# EAGLE design buslamp-r4 (EAGLE 6.4)
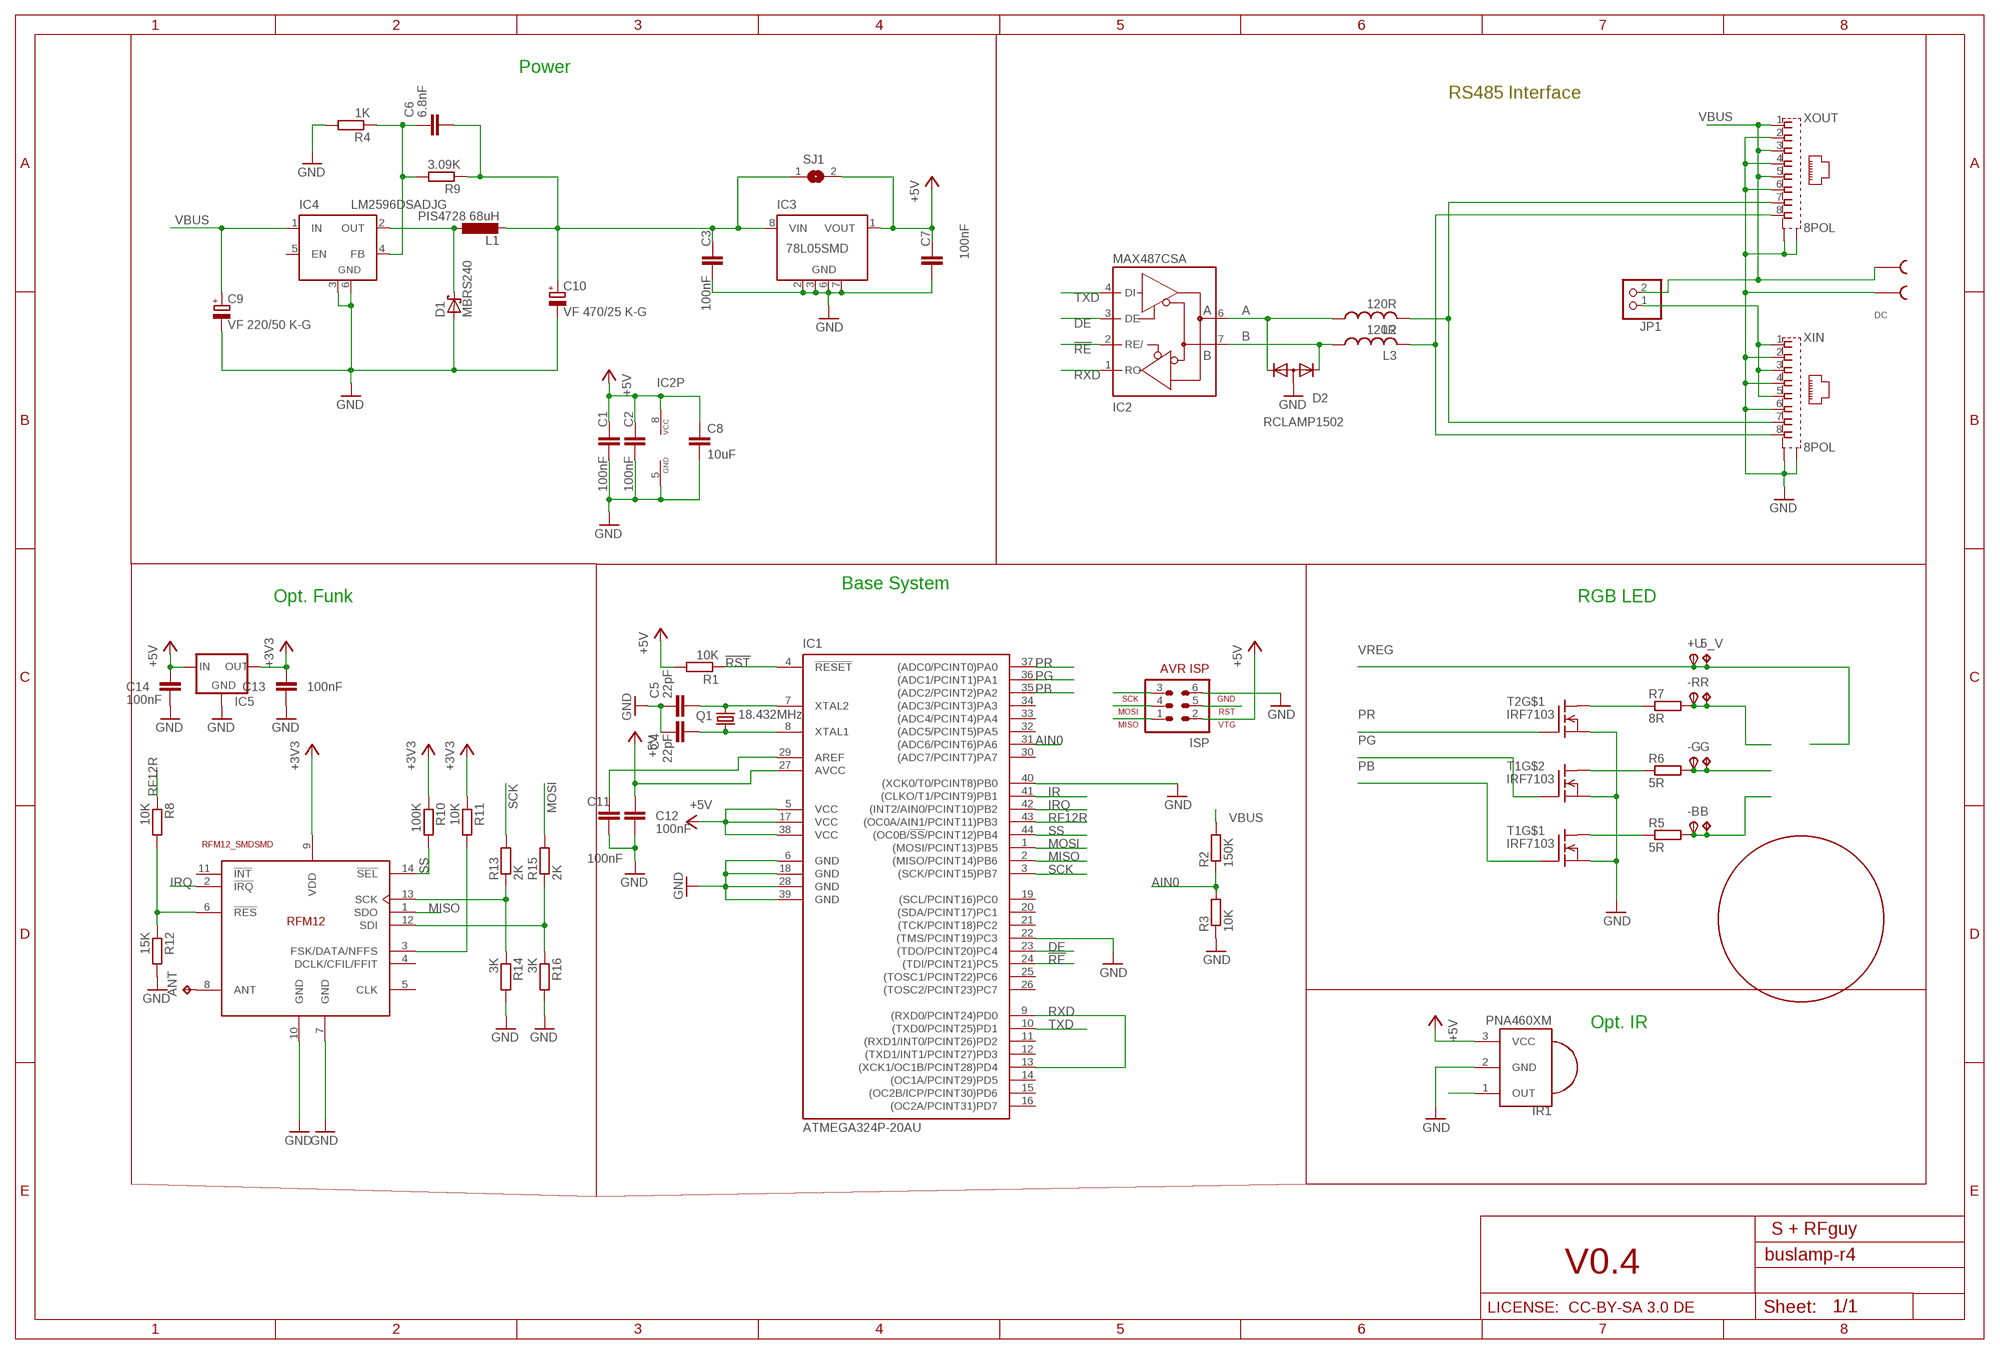
[diagram p0: schematic, sheet 1]

## Parts
5_V  TPPAD1-13  [P1-13]
+U  TPSTP212R  [TP212R]
-B  TPSTP212R  [TP212R]
-G  TPSTP212R  [TP212R]
-R  TPSTP212R  [TP212R]
ANT  TPPAD1-13  [P1-13]
B  TPPAD1-13  [P1-13]
C1  100nF  C-EUC0805K  [C0805K]
C2  100nF  C-EUC0805K  [C0805K]
C3  100nF  C-EUC0805K  [C0805K]
C4  22pF  C-EUC0805K  [C0805K]
C5  22pF  C-EUC0805K  [C0805K]
C6  6.8nF  C-EUC0805K  [C0805K]
C7  100nF  C-EUC0805K  [C0805K]
C8  10uF  C-EUC1210  [C1210]
C9  VF 220/50 K-G  CPOL-EUUD-10X10  [UD-10X10_NICHICON]
C10  VF 470/25 K-G  CPOL-EUUD-10X10  [UD-10X10_NICHICON]
C11  100nF  C-EUC0805  [C0805]
C12  100nF  C-EUC0805  [C0805]
C13  100nF  C-EUC0805  [C0805]
C14  100nF  C-EUC0805  [C0805]
D1  MBRS240  MBRS130LT3  [SMB]
D2  RCLAMP1502  DIODE-2CA|ACSOT23  [SOT23]
DC  STL-266-2  [STL-266-2]
G  TPPAD1-13  [P1-13]
IC1  ATMEGA324P-20AU  MEGA164P/324P/644P-AU  [TQFP44]
IC2  MAX487CSA  MAX481CSA  [SO08]
IC3  78L05SMD  [SO08]
IC4  LM2596DSADJG  LM2596S  [TO263-5]
IC5  MCP1700SOT23  [SOT23]
IR1  PNA460XM  [PNA460XM]
ISP  AVR-ISP-6  [AVR-ISP-6]
JP1  PINHD-1X2  [1X02]
L1  PIS4728 68uH  PSI4728  [PIS4728]
L2  120R  L-USL0603  [L0603]
L3  120R  L-USL0603  [L0603]
Q1  18.432MHz  CRYTALHC49S  [HC49/S]
R  TPPAD1-13  [P1-13]
R1  10K  R-EU_M0805  [M0805]
R2  150K  R-EU_R0805  [R0805]
R3  10K  R-EU_R0805  [R0805]
R4  1K  R-EU_M0805  [M0805]
R5  5R  R-EU_0617/17  [0617/17]
R6  5R  R-EU_0617/17  [0617/17]
R7  8R  R-EU_0617/17  [0617/17]
R8  10K  R-EU_M0805  [M0805]
R9  3.09K  R-EU_M0805  [M0805]
R10  100K  R-EU_M0805  [M0805]
R11  10K  R-EU_M0805  [M0805]
R12  15K  R-EU_M0805  [M0805]
R13  2K  R-EU_M0805  [M0805]
R14  3K  R-EU_M0805  [M0805]
R15  2K  R-EU_M0805  [M0805]
R16  3K  R-EU_M0805  [M0805]
RF1  RFM12_SMDSMD  [RFM12]
SJ1  SJ  [SJ]
T1  IRF7103  [SO-8]
T2  IRF7103  [SO-8]
U$2  KK-STERN  [STERN]
XIN  8POL  [8POL]
XOUT  8POL  [8POL]

## Nets
!RE: IC1.24((TDI/PCINT21)PC5) IC2.2(RE/)
!RST: IC1.4(!RESET) ISP.5 R1.1
+3V3: C13.2 IC5.2(OUT) R10.1 R11.1 RF1.9(VDD)
+5V: C1.1 C2.1 C7.1 C8.1 C12.2 C14.2 IC1.5(VCC) IC1.17(VCC) IC1.27(AVCC) IC1.38(VCC) IC2.8(VCC) IC3.1(VOUT) IC5.3(IN) IR1.3(VCC) ISP.2 R1.2 SJ1.2
A: L2.2 XIN.7 XOUT.7
AIN0: IC1.31((ADC6/PCINT6)PA6) R2.1 R3.2
B: L3.2 XIN.8 XOUT.8
DE: IC1.23((TDO/PCINT20)PC4) IC2.3(DE)
G: -G.TP(PP) G.TP R6.2
GND: C1.2 C2.2 C3.2 C4.1 C5.1 C7.2 C8.2 C9.- C10.- C11.1 C12.1 C13.1 C14.1 D1.A D2.3(A) DC.P$3 IC1.6(GND) IC1.18(GND) IC1.22((TMS/PCINT19)PC3) IC1.28(GND) IC1.39(GND) IC1.40((XCK0/T0/PCINT8)PB0) IC2.5(GND) IC3.2(GND) IC3.3(GND) IC3.6(GND) IC3.7(GND) IC4.3(GND) IC4.6(GND) IC5.1(GND) IR1.2(GND) ISP.6 R3.1 R4.2 R12.2 R14.2 R16.2 RF1.7(GND) RF1.10(GND) T1.1(S) T1.3(S) T2.1(S) XIN.2 XIN.4 XIN.6 XIN.S1 XIN.S2 XOUT.2 XOUT.4 XOUT.6 XOUT.S1 XOUT.S2
IR: IC1.41((CLKO/T1/PCINT9)PB1) IR1.1(OUT)
IRQ: IC1.42((INT2/AIN0/PCINT10)PB2) RF1.2(!IRQ)
MISO: IC1.2((MISO/PCINT14)PB6) ISP.1 RF1.1(SDO)
MOSI: IC1.1((MOSI/PCINT13)PB5) ISP.4 R15.2
N$1: R7.1 T2.8(D1)
N$2: R8.2 R12.1 RF1.6(!RES)
N$3: C6.1 IC4.4(FB) R4.1 R9.2
N$4: R6.1 T1.5(D1)
N$5: R5.1 T1.8(D1)
N$6: -B.TP(PP) B.TP R5.2
N$7: R13.1 R14.1 RF1.13(SCK)
N$8: R15.1 R16.1 RF1.12(SDI)
N$9: ANT.TP RF1.8(ANT)
N$10: D1.C IC4.2(OUT) L1.1
N$12: D2.2(K2) IC2.6(A) L2.1
N$13: D2.1(K1) IC2.7(B) L3.1
N$15: R11.2 RF1.3(FSK/DATA/NFFS)
N$29: C11.2 IC1.29(AREF)
PB: IC1.35((ADC2/PCINT2)PA2) T1.2(G)
PG: IC1.36((ADC1/PCINT1)PA1) T1.4(G)
PR: IC1.37((ADC0/PCINT0)PA0) T2.2(G)
R: -R.TP(PP) R7.2 R.TP
RF12R: IC1.43((OC0A/AIN1/PCINT11)PB3) R8.1
RXD: IC1.9((RXD0/PCINT24)PD0) IC1.13((XCK1/OC1B/PCINT28)PD4) IC2.1(RO)
SCK: IC1.3((SCK/PCINT15)PB7) ISP.3 R13.2
SS: IC1.44((OC0B/!SS!/PCINT12)PB4) R10.2 RF1.14(!SEL)
TXD: IC1.10((TXD0/PCINT25)PD1) IC2.4(DI)
VBUS: C9.+ DC.P$4 IC4.1(IN) JP1.2 R2.2 XOUT.1 XOUT.3 XOUT.5
VBUSOUT: JP1.1 XIN.1 XIN.3 XIN.5
VREG: 5_V.TP +U.TP(PP) C3.1 C6.2 C10.+ IC3.8(VIN) L1.2 R9.1 SJ1.1
XTAL1: C5.2 IC1.7(XTAL2) Q1.2
XTAL2: C4.2 IC1.8(XTAL1) Q1.1
Unconnected: IC1.11((RXD1/INT0/PCINT26)PD2) IC1.12((TXD1/INT1/PCINT27)PD3) IC1.14((OC1A/PCINT29)PD5) IC1.15((OC2B/ICP/PCINT30)PD6) IC1.16((OC2A/PCINT31)PD7) IC1.19((SCL/PCINT16)PC0) IC1.20((SDA/PCINT17)PC1) IC1.21((TCK/PCINT18)PC2) IC1.25((TOSC1/PCINT22)PC6) IC1.26((TOSC2/PCINT23)PC7) IC1.30((ADC7/PCINT7)PA7) IC1.32((ADC5/PCINT5)PA5) IC1.33((ADC4/PCINT4)PA4) IC1.34((ADC3/PCINT3)PA3) IC3.4(NC) IC3.5(NC) IC4.5(EN) RF1.4(DCLK/CFIL/FFIT) RF1.5(CLK) RF1.11(!INT) T1.6(D) T1.7(D) T2.3(S) T2.4(G) T2.5(D1) T2.6(D) T2.7(D)

## Notes on the sheet
- Power
- RS485 Interface
- Base System
- Opt. Funk | RGB LED
- RF12R | IR
- SCK | IRQ
- MOSI
- RF12R
- SS
- MOSI
- MISO
- SS | SCK
- IRQ
- MISO
- Opt. IR
- S + RFguy
- V0.4
- LICENSE:  CC-BY-SA 3.0 DE

## Library data of the parts
5_V ANT B G R = testpad:TP: Test pad
+U -B -G -R = testpad:TPS: TEST PIN
C1-C8 C11-C14 = rcl:C-EU: CAPACITOR, European symbol
C9 C10 = rcl:CPOL-EU: POLARIZED CAPACITOR, European symbol
D1 = diode:MBRS130LT3: Schottky Power Rectifier Source: http://www.onsemi.com/pub/Collateral/MBRS130LT3-D.PDF
D2 = diode:DIODE-2CA|AC: Dual DIODE Cathode-Anode|Anode-Cathode
DC = xtort:STL-266-2
IC1 = avr-5:MEGA164P/324P/644P-AU
IC2 = maxim:MAX481CSA: RS485 TRANSEIVER
IC3 = linear:78L*SMD: Positive VOLTAGE REGULATOR
IC4 = linear:LM2596S: STEP-DOWN VOLTAGE REGULATOR
IC5 = adafruit:MCP1700: VOLTAGE REGULATOR
IR1 = adafruit:PNA460XM: IR 38KHz receiver PNA4602 and related receivers http://www.ladyada.net/library/pcb/eaglelibrary.html
ISP = avr-6:AVR-ISP-6: AVR ISP-6 Serial Programming Header
JP1 = pinhead:PINHD-1X2: PIN HEADER
L1 = rcl:PSI4728
L2 L3 = rcl:L-US: INDUCTOR, American symbol
Q1 = crystal:CRYTAL: CRYSTAL
R1-R4 R8-R16 = rcl:R-EU_: RESISTOR, European symbol
R5-R7 = rclml:R-EU_: RESISTOR, European symbol
RF1 = rfm_12:RFM12_SMD: RFM12 is a low costing ISM band transceiver module implemented with unique PLL. It works signal ranges from 315/433/868/915MHZ bands, comply with FCC, ETSI regulation. The SPI interface is used to communicate with microcontroller for parameter setting.
SJ1 = jumper:SJ: SMD solder JUMPER
T1 T2 = transistor-fet+irf7201:IRF7103
U$2 = ledccc:KK-STERN: LED Kühlkörper Stern
XIN XOUT = con-amp:8POL

## Board
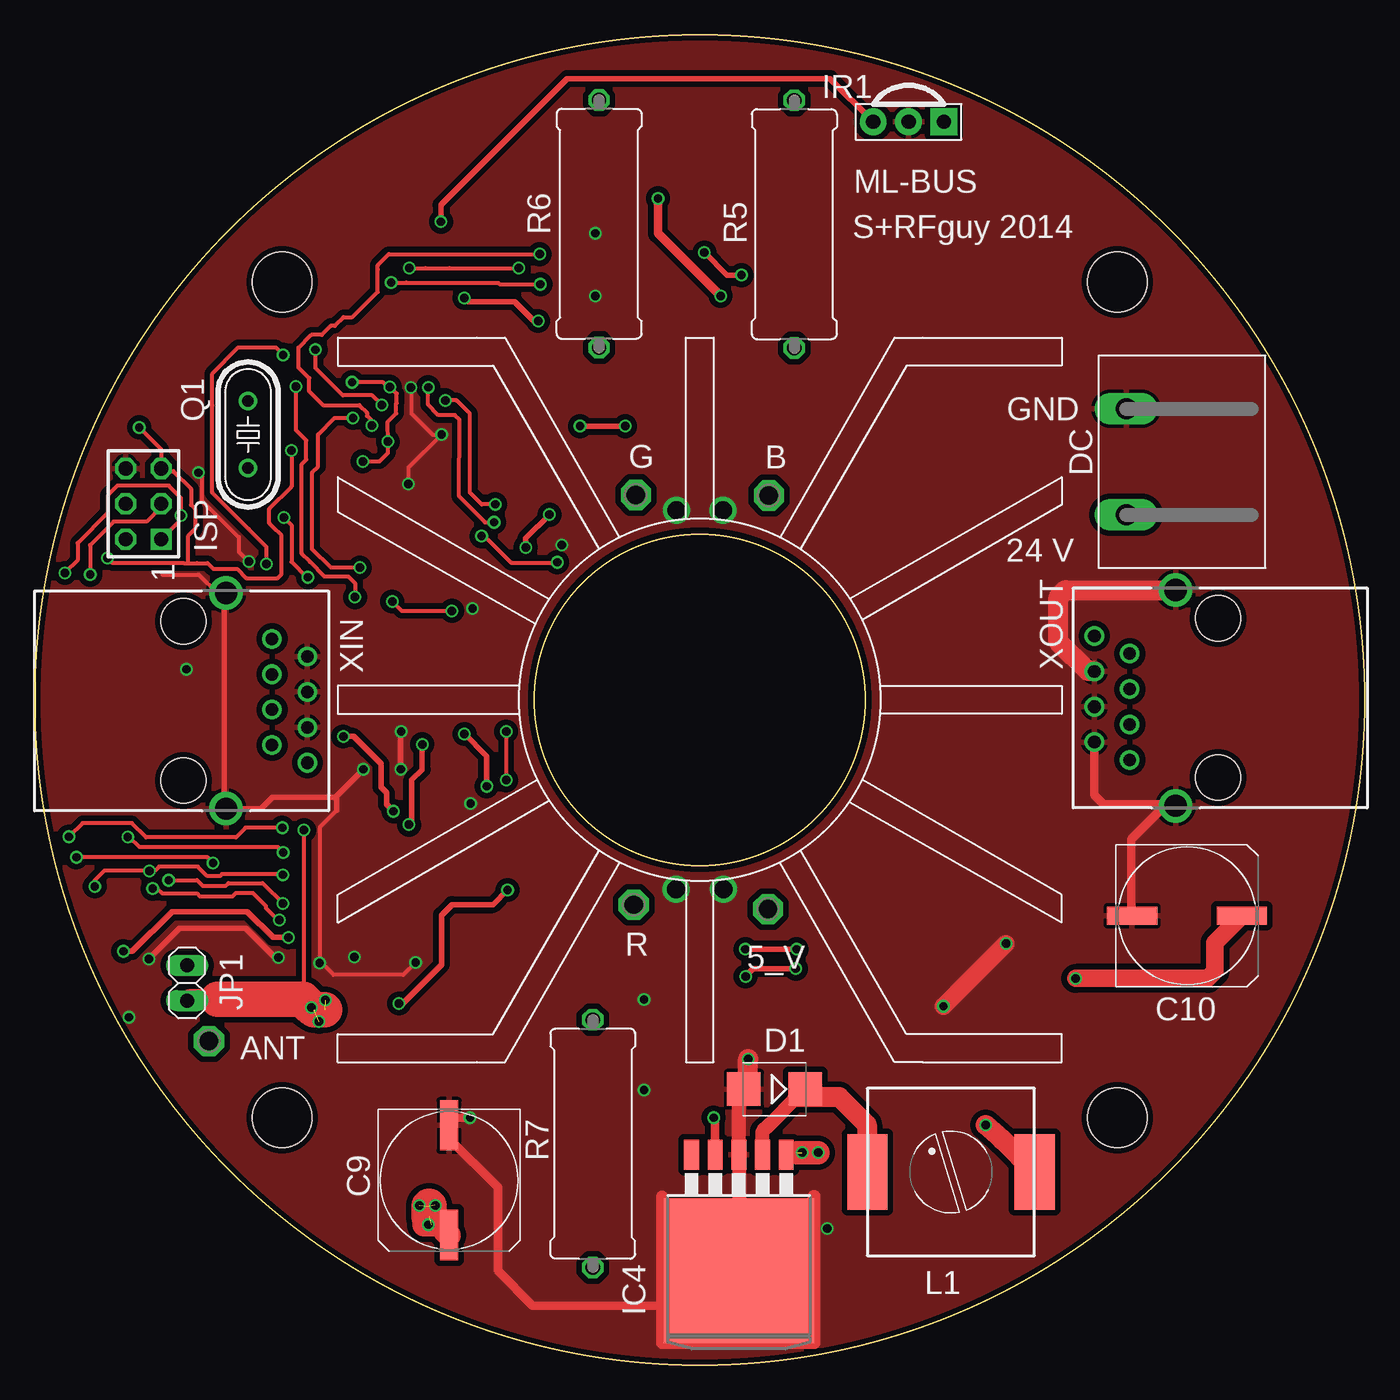
[diagram p1: board, top side]
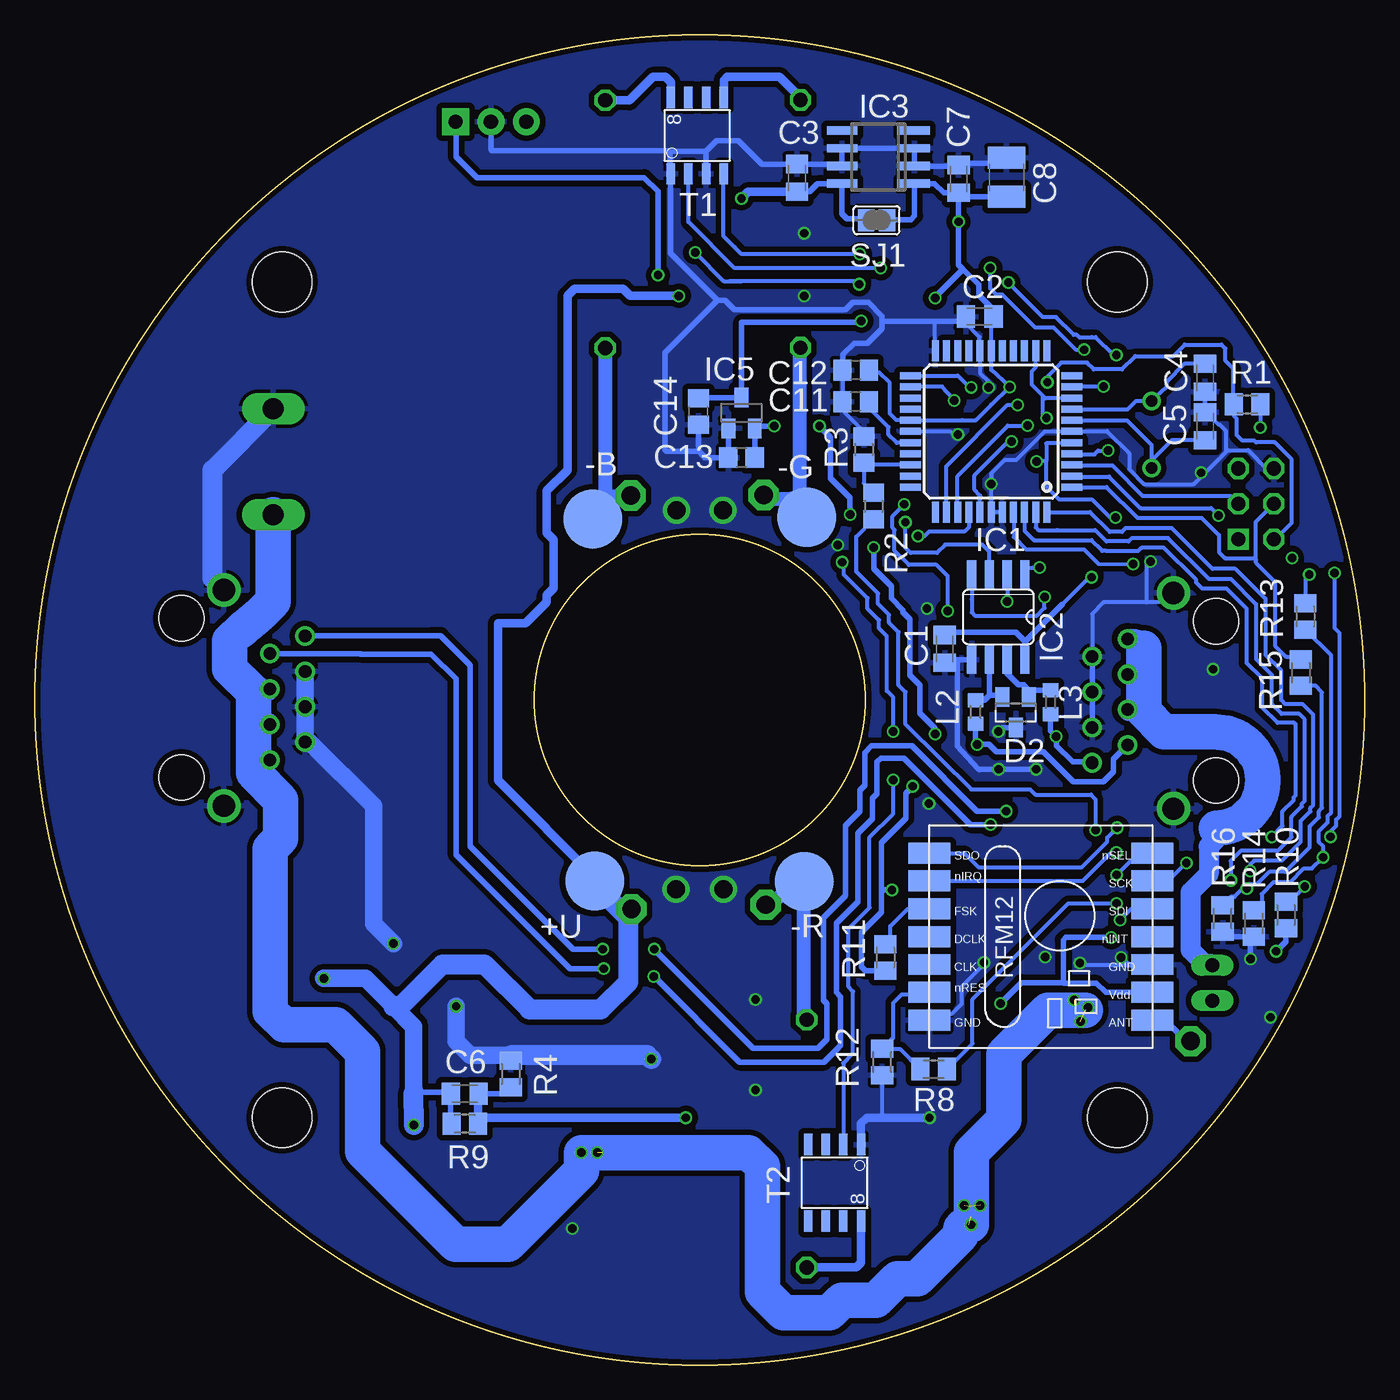
[diagram p2: board, bottom side, seen from below]

Size 95.51 x 95.51 mm. Coordinates in mm from the lower left corner, seen from the top.
Outline: circle at 47.76,47.77 radius 11.88
Outline: circle at 47.76,47.76 radius 47.76
Copper layers (1*16): Top 0.035mm / dielectric 1.5mm / Bottom 0.035mm
Design rules "SeeedStudio_2layer_DRU_no_angle_20140221": minimum track width 6mil, minimum drill 12mil, track to track 6mil, track to pad 6mil, pad to pad 6mil, via to via 6mil, smd to smd 0mil, copper to edge 10mil, drill to drill 10mil, minimum pad ring 10mil, minimum via ring 6mil, stop-mask expansion 2mil, vias tented up to drill 100mil, thermal gap 10mil
Holes 4.3 mm at 77.76,77.77 17.76,17.77 17.76,77.77 77.76,17.77

### Footprints (pad centres in the part's own frame; a part is rotated, then mirrored left to right if it is on the bottom)
P1-13 = drill 1.321 pad 2.159 octagon: TP 0,0
TP212R = smd 4.24 x 4.24: TP 0,0
C0805K = smd 1.3 x 1.6: 1 -1,0; 2 1,0
C1210 = smd 1.6 x 2.7: 1 -1.4,0; 2 1.4,0
UD-10X10_NICHICON = smd 3.6 x 1.3: + 3.925,0; - -3.95,0
C0805 = smd 1.3 x 1.5: 1 -0.95,0; 2 0.95,0
SMB = smd 2.4 x 2.4: A 2.2,0; C -2.2,0
SOT23 = smd 1 x 1.4: 1 -0.95,-1.1; 2 0.95,-1.1; 3 0,1.1
STL-266-2 = drill 1.5 long: P$3 -3.81,-4; P$4 3.81,-4
TQFP44 = smd 1.5 x 0.5: 1 -5.8,4; 2 -5.8,3.2; 3 -5.8,2.4; 4 -5.8,1.6; 5 -5.8,0.8; 6 -5.8,0; 7 -5.8,-0.8; 8 -5.8,-1.6; 9 -5.8,-2.4; 10 -5.8,-3.2; 11 -5.8,-4; 23 5.8,-4; 24 5.8,-3.2; 25 5.8,-2.4; 26 5.8,-1.6; 27 5.8,-0.8; 28 5.8,0; 29 5.8,0.8; 30 5.8,1.6; 31 5.8,2.4; 32 5.8,3.2; 33 5.8,4 | smd 0.5 x 1.5: 12 -4,-5.8; 13 -3.2,-5.8; 14 -2.4,-5.8; 15 -1.6,-5.8; 16 -0.8,-5.8; 17 0,-5.8; 18 0.8,-5.8; 19 1.6,-5.8; 20 2.4,-5.8; 21 3.2,-5.8; 22 4,-5.8; 34 4,5.8; 35 3.2,5.8; 36 2.4,5.8; 37 1.6,5.8; 38 0.8,5.8; 39 0,5.8; 40 -0.8,5.8; 41 -1.6,5.8; 42 -2.4,5.8; 43 -3.2,5.8; 44 -4,5.8
SO08 = smd 0.66 x 2.032: 1 -1.905,-3.073; 2 -0.635,-3.073; 3 0.635,-3.073; 4 1.905,-3.073; 5 1.905,3.073; 6 0.635,3.073; 7 -0.635,3.073; 8 -1.905,3.073
SO08' = smd 0.6 x 2.2: 1 -1.905,-2.6; 2 -0.635,-2.6; 3 0.635,-2.6; 4 1.905,-2.6; 5 1.905,2.6; 6 0.635,2.6; 7 -0.635,2.6; 8 -1.905,2.6
TO263-5 = smd 1.067 x 2.159: 1 -3.404,-5.791; 2 -1.702,-5.791; 3 0,-5.791; 4 1.702,-5.791; 5 3.404,-5.791 | smd 10.8 x 10.41: 6 0,2.54
PNA460XM = drill 1.016 pad 1.93 square: 1 -2.54,0 | drill 1.016 pad 1.93: 2 0,0; 3 2.54,0
AVR-ISP-6 = drill 1.016 square: 1 -2.54,-1.27 | drill 1.016 octagon: 2 -2.54,1.27; 3 0,-1.27; 4 0,1.27; 5 2.54,-1.27; 6 2.54,1.27
1X02 = drill 1.016 long: 1 -1.27,0; 2 1.27,0
PIS4728 = smd 5.4 x 2.9: 1 0,6; 2 0,-6
L0603 = smd 1 x 1.1: 1 -0.85,0; 2 0.85,0
HC49/S = drill 0.813: 1 -2.413,0; 2 2.413,0
M0805 = smd 1.3 x 1.6: 1 -0.95,0; 2 0.95,0
R0805 = smd 1.3 x 1.5: 1 -0.95,0; 2 0.95,0
0617/17 = drill 1.016 octagon: 1 -8.89,0; 2 8.89,0
RFM12 = smd 1.5 x 3: 1 -5,-10; 2 -3,-10; 3 -1,-10; 4 1,-10; 5 3,-10; 6 5,-10; 7 7,-10; 8 7,6; 9 5,6; 10 3,6; 11 1,6; 12 -1,6; 13 -3,6; 14 -5,6
SJ = smd 1.168 x 1.6: 1 -0.762,0; 2 0.762,0
SO-8 = smd 1.524 x 0.61: 1 -2.743,1.27; 2 -2.743,0; 3 -2.743,-1.27; 4 -2.743,-2.54; 5 2.743,-2.54; 6 2.743,-1.27; 7 2.743,0; 8 2.743,1.27
8POL = drill 0.9: 1 -4.445,6.35; 2 -3.175,8.89; 3 -1.905,6.35; 4 -0.635,8.89; 5 0.635,6.35; 6 1.905,8.89; 7 3.175,6.35; 8 4.445,8.89 | drill 1.6: S1 -7.745,3.05; S2 7.745,3.05 | hole 3.25: -5.715,0; 5.715,0

### Placement (x,y rotation side)
5_V  52.66,32.75 0 top
+U  55.31,34.76 0 bottom
-B  55.44,60.74 0 bottom
-G  40.08,60.88 0 bottom
-R  40.25,34.73 0 bottom
ANT  12.51,23.27 0 top
B  52.72,62.44 0 top
C1  30.16,51.43 270 bottom
C2  27.65,75.29 180 bottom
C3  40.78,85.24 90 bottom
C4  11.47,70.9 90 bottom
C5  11.47,67.41 270 bottom
C6  64.64,19.49 180 bottom
C7  29.17,85.17 90 bottom
C8  25.73,85.29 90 bottom
C9  29.76,13.27 270 top
C10  82.76,32.27 0 top
C11  36.57,69.18 0 bottom
C12  36.56,71.44 0 bottom
C13  44.76,65.17 0 bottom
C14  47.86,68.47 90 bottom
D1  53.13,19.82 180 top
D2  25.07,46.87 180 bottom
DC  82.39,64.86 270 top
G  43.17,62.48 0 top
IC1  26.83,67.04 180 bottom
IC2  26.32,53.72 180 bottom
IC3  78L05SMD  [SO08']  34.94,86.74 90 bottom
IC4  50.57,9.31 180 top
IC5  44.76,68.37 0 bottom
IR1  62.76,89.27 180 top
ISP  7.81,61.84 90 top
JP1  10.94,27.44 270 top
L1  65.8,13.87 90 top
L2  27.95,46.89 270 bottom
L3  22.56,47.6 270 bottom
Q1  15.32,66.82 270 top
R  43.02,33.06 0 top
R1  8.44,69 180 bottom
R2  35.27,61.68 270 bottom
R3  35.97,65.73 270 bottom
R4  61.33,20.91 90 bottom
R5  54.55,81.92 270 top
R6  40.53,81.95 270 top
R7  40.08,15.91 90 top
R8  30.95,21.26 180 bottom
R9  64.63,17.34 0 bottom
R10  5.66,32.32 90 bottom
R11  34.43,29.27 90 bottom
R12  34.66,21.77 270 bottom
R13  4.27,53.76 90 bottom
R14  7.96,31.72 270 bottom
R15  4.6,49.72 90 bottom
R16  10.21,32.07 270 bottom
RF1  21.26,31.77 270 bottom
SJ1  35.06,82.21 0 bottom
T1  48.58,88.28 90 bottom
T2  37.44,13.1 270 bottom
U$2  47.76,47.77 0 top
XIN  10.69,47.7 270 top
XOUT  84.99,47.91 90 top

### Tracks (layer width: path | path; a pad name or v marks a point on that pad's centre or on a via)
!RE  (via drill 0.6)
  Top 0.305: v25.68,54.83 26.35,54.16 v29.96,54.16 | v33.07,61.81 32.1,61.81 31.26,62.65 31.25,68.3 30.29,69.27 v29.48,69.27
  Bottom 0.305: IC2.2 v25.68,54.83 | v29.96,54.16 v29.95,54.17 29.95,56.65 30.76,57.46 32.75,57.46 33.76,58.47 33.76,59.97 33.91,60.12 33.91,60.97 v33.07,61.81 | v29.48,69.27 30.36,70.26 IC1.24
!RST  (via drill 0.6)
  Top 0.305: v18.44,65.67 18.44,63.08 16.84,61.48 16.84,60.46 17.12,60.18 17.72,59.58 17.72,56.8 17.43,56.51 15.19,56.51 14.53,57.17 12.82,57.17 12.41,57.58 11.63,57.58 10.99,57.58 | 10.99,57.58 10.69,57.58 5.6,57.58 v5.22,57.96 | v7.5,67.33 9.08,65.75 ISP.5 9.27,64.19 9.95,64.19 11.23,62.91 11.23,61.77 11.52,61.48 11.52,60.04 10.99,59.51 10.99,57.58
  Bottom 0.305: IC1.4 20.99,65.4 19.41,65.4 19.15,65.66 v18.44,65.67 | R1.1 v7.5,67.33
+3V3  (via drill 0.6)
  Top 0.406: v26.16,25.97 26.41,25.97 29.21,28.77 29.21,32.32 29.96,33.07 32.91,33.07 v33.96,34.12 | v6.36,29.72 7.01,29.72 9.86,32.57 15.26,32.57 17.11,30.72 v18.21,30.72 | v32.46,41.57 32.46,43.72 v30.86,45.32 | v35.26,58.72 35.26,59.37 v36.96,61.07 | v39.16,67.42 v42.41,67.42
  Bottom 0.305: RF1.9 14.78,27.25
  Bottom 0.406: R11.1 35.86,28.32 36.16,28.62 36.16,31.07 34.71,32.52 34.71,33.97 | 34.71,33.97 34.71,37.52 32.96,39.27 32.96,41.07 v32.46,41.57 | RF1.9 18.61,26.77 19.26,27.42 21.61,27.42 21.66,27.47 | v26.16,25.97 24.66,27.47 21.66,27.47 | v33.96,34.12 34.56,34.12 34.71,33.97 | R10.1 5.66,30.42 v6.36,29.72 | v18.21,30.72 21.46,30.72 21.66,30.52 21.66,27.47 | v30.86,45.32 30.86,45.72 31.96,46.82 31.96,48.82 32.66,49.52 32.66,53.57 33.16,54.07 33.16,54.22 34.01,55.07 34.01,55.92 35.26,57.17 v35.26,58.72 | v36.96,61.07 36.96,62.27 38.36,63.67 38.36,66.62 v39.16,67.42 | v42.41,67.42 43.66,67.42 IC5.2 C13.2
+5V  (via drill 0.6)
  Top 0.305: 25.35,66.23 25.36,65.99 v25.36,66.31 | v25.36,66.31 25.35,67.72 25.97,68.34 25.97,69.06 25.99,69.08 25.99,69.76 25.52,70.24 v25.5,70.24 25.35,70.24 25.02,70.57 v22.79,70.57 | v23.56,64.89 24.75,64.89 25.36,65.5 v25.36,66.31 | v17.9,60.86 18.44,60.32 18.44,57.67 19.54,56.57 v19.62,56.57
  Top 0.406: IR1.3 57.12,92.37 38.23,92.37 29.17,83.31 v29.17,82.1 | v36.16,74.97 35.86,74.97 34.46,76.37 31.11,76.37 v30.86,76.62
  Bottom 0.305: 26.81,74.85 26.81,72.86 IC1.17 26.82,71.47 v25.5,70.24 26.83,68.96 27.94,67.85 28.91,67.85 28.92,67.84 IC1.27 33.64,67.85 34.11,68.32 34.11,70.52 34.86,71.27 35.44,71.27 C12.2 | IC1.5 21.08,66.19 22.87,66.19 22.87,64.9 | 22.87,64.9 v23.56,64.89 | 22.87,64.9 22.87,63.08 21.96,62.17 19.6,62.17 18.14,60.71 18.05,60.71 v17.9,60.86 | IC1.38 27.63,62.44 28.03,62.84 28.03,63.89 25.69,66.23 25.35,66.23 v25.36,66.31 | v19.62,56.57 19.79,56.57 21.73,54.63 | v22.79,70.57 22.79,70.98 21.79,71.98 19.94,71.98 19.46,71.5 17.43,71.5 16.49,72.44 13.76,72.44 12.93,73.27 10.3,73.27 10.01,72.98 10.01,72.11 9.44,71.54 9.44,69.05 R1.2 9.39,68.16 9.19,67.96 9.19,66.78 8.79,66.38 7.94,66.38 7.82,66.26 6.46,66.26 5.24,65.04 5.24,60.48 6.42,59.3 ISP.2
  Bottom 0.406: 21.73,54.63 24.41,51.95 IC2.8 24.41,51.99 25.06,52.64 29.95,52.64 C1.1 | C7.1 30.24,84.17 30.91,84.84 IC3.1 32.34,82.51 32.61,82.24 34.26,82.24 SJ1.2 | C7.1 28.89,83.89 26.76,83.89 | 26.76,83.89 C8.1 | 26.45,83.58 26.76,83.89 | C7.1 v29.17,82.1 29.17,79.01 28.84,78.68 | 28.84,78.68 27.72,77.56 27.72,76.82 26.65,75.75 C2.1 26.81,75.13 26.81,74.85 | C14.2 47.81,69.47 IC5.3 44.76,74.87 36.26,74.87 v36.16,74.97 | v30.86,76.62 30.86,76.67 28.84,78.68
A  (via drill 0.6)
  Top 0.406: v54.66,28.47 51.58,28.47 51.05,27.94 v51.05,27.91 | v26.88,38.81 27.08,39.01 27.08,42.02 27.83,42.77 v27.83,44.57
  Bottom 0.406: XOUT.7 78.62,51.07 72.12,51.07 72.11,51.06 67.58,51.06 67.05,51.06 65.26,49.27 65.26,36.64 60.95,32.33 57.09,28.47 v54.66,28.47 | XIN.7 18.05,43.51 18.05,42.61 18.78,41.88 20.92,41.88 23.07,44.03 26.44,44.03 26.98,44.57 v27.83,44.57 27.95,44.69 L2.2 | v51.05,27.91 44.91,21.77 38.83,21.77 37.79,22.81 37.79,22.82 37.66,22.95 37.66,26.47 37.95,26.76 37.95,31.73 36.41,33.27 36.41,38.19 35.76,38.84 35.36,39.24 35.36,40.69 35.02,41.03 35.02,43.33 34.76,43.59 33.09,43.59 28.31,38.81 v26.88,38.81 26.88,38.79
AIN0
  Bottom 0.305: IC1.31 35.84,64.65 R3.2 35.97,63.33 R2.1
B  (via drill 0.6)
  Top 0.406: v54.72,29.87 v51.03,29.87 | v25.76,39.77 25.26,40.27 25.26,41.1 24.86,41.5 24.86,43.18 23.82,44.22 22.89,45.14 v22.16,45.14
  Bottom 0.406: XIN.8 19.63,43.31 20.96,43.31 20.97,43.31 22.14,44.48 22.14,45.12 v22.16,45.14 22.56,45.54 L3.2 | XOUT.8 76.07,52.38 67,52.38 66.37,52.38 64.26,50.27 64.26,37.27 59.76,32.77 56.86,29.87 v54.72,29.87 | v51.03,29.87 43.93,22.77 39.26,22.77 38.64,23.39 38.64,25.97 38.88,26.21 38.88,32.11 37.29,33.7 37.29,38.48 37.29,38.74 36.76,39.27 36.26,39.77 36.26,41.27 35.9,41.63 35.9,43.98 35.42,44.46 32.53,44.46 27.84,39.77 27.56,39.77 v25.76,39.77
DE  (via drill 0.6)
  Top 0.305: 28.26,70.13 v28.26,70.21 28.26,68.94 28.98,68.22 30.17,68.22 30.5,67.89 30.48,62.38 32.34,60.52 v32.99,60.52
  Bottom 0.305: IC1.23 32.61,71.02 32.59,71.04 29.22,71.04 28.39,70.21 v28.26,70.21 | IC2.3 26.96,58.41 27.46,58.91 30.13,58.91 30.71,58.33 32.62,58.33 32.99,58.7 v32.99,60.52
G
  Bottom 0.406: -G.TP 40.08,60.86 40.17,60.77
  Bottom 1.016: R6.2 40.6,73.3 40.6,61.66 40.17,61.23 40.17,60.77 40.17,60.38 | G.TP 43.05,62.21 41.16,62.21 40.08,61.13 -G.TP
GND  (via drill 0.6, 1.3)
  Top 0.305: v26.83,63.27 26.83,64.42 v29.22,66.82 28.57,66.82 27.04,68.35 27.04,70.15 v27,70.19 | 9.16,56.77 11.76,56.77 13.08,55.44 XIN.S1 | 21.67,39.85 20.46,38.64 v20.46,28.88 20.6,28.88 21.46,28.02 26.46,28.02 v27.35,28.91 | v11.75,64.08 12,63.83 12,62.11 14.65,59.46 14.65,58.39 15.33,57.71 v15.38,57.71
  Top 0.406: XIN.S1 13.74,54.87 13.61,54.74 13.61,40.08 XIN.S2 16.26,39.95 17.1,40.79 21.61,40.79 21.67,40.85 | v23.61,42.79 21.67,40.85 | 21.67,39.85 21.67,40.85 | v26.31,45.49 26.29,45.5 v26.29,42.79 | v17.51,29.27 17.26,29.27 15.16,31.37 10.41,31.37 v8.21,29.17
  Top 0.61: 51.26,6.77 IC4.6 | 51.26,6.77 51.26,4.27 35.76,4.27 33.26,6.77 33.26,12.77 29.76,16.27 C9.- 30.31,17.77 v31.26,17.77 | 51.26,7.27 51.26,6.77 | C10.- 78.76,32.32 78.76,37.77 81.15,40.16 XOUT.S1 81.83,40.27 76.76,40.27 76.1,40.93 XOUT.2
  Top 0.813: 50.57,9.04 55.91,9.04 55.91,12.17 56.01,12.17 56.01,1.57 45.06,1.57 45.06,12.12
  Top 1.016: D1.A 50.57,18.96 IC4.3 50.57,9.04 IC4.6
  Top 1.27: v65.26,25.77 v69.76,30.27
  Top 1.422: XOUT.6 76.08,49.83 75.66,49.83 73.53,51.96 73.53,55.16 74.02,55.65 XOUT.S2 | D1.A 51.23,20.12 v51.23,21.98
  Bottom 0.305: IC1.28 29.76,67.04 29.54,66.82 v29.22,66.82 | 28.45,75.15 28.45,75.4 C2.2 28.65,74.8 27.67,73.82 27.67,72.94 27.6,72.87 IC1.18 27.63,71.23 27,70.6 v27,70.19 | IC1.22 30.86,72.87 30.86,74.95 | C4.1 C5.1 10.9,68.41 10.9,67.93 10.51,67.54 10.43,67.54 9.99,67.1 9.99,65.55 | XIN.S1 14.41,54.77 15.67,54.77 | 15.67,54.77 18.76,54.77 19.58,53.95 XIN.2 | v26.83,63.27 IC1.39 IC1.40 | v26.83,63.27 26.83,63.92 | v26.83,63.27 26.83,64.03 25.87,64.99 25.04,64.99 22.99,67.04 IC1.6 21.01,67.06 18.51,67.06 16.92,65.47 16.92,64.33 15.85,63.25 12.29,63.25 11.75,63.79 | v20.46,28.88 20.35,28.77 RF1.10 | RF1.7 30.79,25.24 29.64,25.24 28.94,25.94 28.94,27.2 27.35,28.79 v27.35,28.91 | 11.75,63.79 9.99,65.55 | 9.99,65.55 9.84,65.7 8.38,65.7 7.06,64.38 ISP.6 | 11.75,63.79 v11.75,64.08 | v15.38,57.71 15.67,57.42 15.67,54.77 | R12.2 34.66,18.07 34.96,17.77 | R3.1 35.97,67.03 37.36,68.42 37.36,69.02 C11.1 37.51,70.92 C12.1
  Bottom 0.406: XIN.6 XIN.4 XIN.2 | IC2.5 29.26,50.64 29.26,47.77 29.27,44.45 27.78,42.81 27.68,42.77 27.66,42.79 v26.29,42.79 v23.61,42.79 | C8.2 26.45,86.69 26.84,86.3 29.04,86.3 C7.2 29.73,86.17 29.81,86.09 32.32,86.09 IC3.2 IC3.3 IC3.6 IC3.7 37.67,86.24 C3.2 40.8,86.22 43.3,86.22 44.98,87.9 46.57,87.9 47.31,87.16 | 47.31,87.16 T1.3 | 49.9,87.19 49.9,85.58 T1.1 49.85,79.83 46.49,76.47 | 49.9,87.19 49.87,87.16 47.31,87.16 | R4.2 61.26,21.93 61.26,22.27 | IR1.2 62.76,87.27 62.68,87.19 49.9,87.19 | 46.49,76.47 45.96,76.47 45.26,75.77 37.31,75.77 36.76,76.32 35.66,76.32 34.66,75.32 34.66,74.97 | D2.3 26.03,45.77 v26.31,45.49 | R16.2 9.86,30.77 R14.2 8.21,30.52 v8.21,29.17 | RF1.10 17.01,28.77 v17.51,29.27 | IC5.1 C13.1 | C14.1 47.86,65.67 47.36,65.17 C13.1 | 34.66,74.97 34.66,74.42 35.71,73.37 36.66,73.37 37.46,72.57 37.46,70.97 37.51,70.92 | 34.66,74.97 34.64,74.95 30.86,74.95 28.99,74.95 C2.2 | C13.1 47.41,65.17 47.86,65.62 50.16,65.62 50.26,65.72 50.26,72.7 46.49,76.47
  Bottom 0.61: T2.1 36.17,17.36 35.76,17.77 34.96,17.77 v31.26,17.77
  Bottom 1.27: 61.26,22.27 64.26,22.27 65.26,23.27 v65.26,25.77 | XOUT.6 XOUT.4 XOUT.2 75.76,44.73 71.19,40.16 71.19,31.7 v69.76,30.27
  Bottom 1.422: XOUT.S2 82.76,56.47 82.76,64.27 78.39,68.64 DC.P$3 | v51.23,21.98 51.52,22.27 61.26,22.27
  other vias: 10.9,49.97 31.3,40.32 43.76,26.27 43.76,19.77 40.26,81.27 40.26,76.77 46.08,61.38 49.43,61.39 49.46,34.18 46.06,34.18 22.96,29.31 6.77,24.98 31.44,54.34 37.85,58.9 56.91,9.82
  pour Bottom (isolate 0.406): -1.74,98.27 99.26,98.27 99.26,-7.23 -1.74,-7.23
  pour Top (isolate 0.406): -3.74,96.77 99.26,96.77 99.26,0.27 99.26,-0.73 -3.74,-0.73
IR  (via drill 0.6)
  Top 0.305: v17.84,72.54 17.31,73.07 15.15,73.07 14.62,73.07 12.75,71.2 12.75,68.9 12.75,62.64 15.37,60.02 16.63,58.76 v16.63,57.52 | v25.59,77.73 26.69,77.72 33.28,77.71 33.38,77.61 v36.32,77.61
  Top 0.406: v50.76,78.27 49.72,78.26 v48.09,79.89
  Bottom 0.305: IC1.41 25.21,61.22 25.21,59.47 24.32,58.58 20.72,58.58 20.71,58.57 20.16,58.57 19.12,57.53 v16.63,57.52 | v36.32,77.61 36.55,77.84 44.74,77.84 | 44.74,77.84 45.61,77.84 | v25.59,77.73 25.59,77.71 23.12,75.24 22.17,75.24 20.9,73.97 20.68,73.97 20.52,73.81 19.62,73.81 19.34,73.81 18.07,72.54 v17.84,72.54 | v48.09,79.89 46.04,77.84 44.74,77.84
  Bottom 0.406: IR1.1 65.26,89.23 65.26,86.77 63.76,85.27 51.76,85.27 50.76,84.27 v50.76,78.27
IRQ  (via drill 0.6)
  Top 0.305: v17.84,36.81 17.46,37.19 7.52,37.19 6.79,37.92 v6.68,37.92
  Bottom 0.305: IC1.42 24.43,59.91 23.76,59.24 19.63,59.24 18.85,58.46 18.59,58.46 18.58,58.45 16.28,58.45 16.04,58.69 14.42,58.69 12.11,56.38 12.11,56.19 11.68,55.76 9.91,55.76 8.49,54.34 8.49,50.45 7.36,49.32 7.36,47.22 6.26,46.12 5.06,46.12 4.96,46.02 4.96,40.92 5.11,40.77 5.11,40.57 5.91,39.77 5.91,38.72 6.68,37.95 v6.68,37.92 | RF1.2 20.26,34.77 18.22,36.81 v17.84,36.81
MISO  (via drill 0.6)
  Top 0.305: v17.78,38.59 15.14,38.59 14.45,37.9 7.99,37.9 6.97,38.92 3.43,38.92 v2.45,37.94 | v10.49,61 10.49,61.3 | v2.17,56.88 3.08,57.79 3.08,59.03 5.24,61.19 5.24,62.46 5.93,63.15 9.62,63.15 10.49,62.28 v10.49,61 | v10.49,61 10.49,60.71 ISP.1
  Bottom 0.305: IC1.2 20.99,63.8 18.36,63.8 16.11,61.54 11.03,61.54 v10.49,61 | RF1.1 28.76,36.77 27.76,35.77 20.31,35.77 18.49,37.59 18.49,37.88 v17.78,38.59 | v2.45,37.94 2.45,38.33 2.06,38.72 2.06,39.17 1.81,39.42 1.81,52.57 2.16,52.92 v2.16,56.87 v2.17,56.88
MOSI
  Bottom 0.305: IC1.1 18.55,63.04 16.33,60.84 11.73,60.84 10.48,59.59 10.48,58.38 10.04,57.94 7.94,57.94 7.81,57.81 | 7.81,57.81 7.81,57.62 6.45,56.26 6.45,51.66 5.66,50.87 4.8,50.87 R15.2 | 7.81,57.81 7.81,60.57 ISP.4
N$1
  Bottom 0.61: T2.8 36.17,7.36 36.26,7.27 36.51,7.02 R7.1
N$2
  Bottom 0.305: RF1.6 31.42,26.61 33.27,26.61 33.88,26 33.88,23.5 R12.1 34.61,22.67 33.36,22.67 31.95,21.26 R8.2
N$3  (via drill 0.6)
  Top 0.61: IC4.4 48.86,17.66 v48.76,17.77
  Bottom 0.406: R4.1 61.8,19.49 C6.1
  Bottom 0.61: v48.76,17.77 63.25,17.77 R9.2 | R9.2 63.68,19.42 C6.1 | R9.2
N$4
  Bottom 0.61: T1.5 46.03,91.03 46.03,92.27 45.81,92.49 42.03,92.49 40.67,91.13 R6.1
N$5
  Bottom 0.61: T1.8 49.83,91.04 49.83,92.1 50.22,92.49 51.13,92.49 52.81,90.81 R5.1
N$6
  Bottom 1.016: R5.2 54.55,62.35 | 54.55,62.35 54.55,61.63 -B.TP | B.TP 52.81,62.35 54.55,62.35
N$7  (via drill 0.6)
  Top 0.305: v12.81,36.07 12.41,36.47 v2.99,36.47
  Bottom 0.305: 4.53,52.55 R13.1 2.42,50.96 2.42,39.68 2.66,39.44 2.66,38.98 3.3,38.34 3.3,37.56 2.99,37.25 v2.99,36.47 3.79,35.67 4.36,35.67 5.36,34.67 6.56,34.67 7.41,33.82 7.41,33.22 R14.1 | RF1.13 14.11,34.77 v12.81,36.07
N$8  (via drill 0.6)
  Top 0.305: v17.56,31.97 17.46,31.97 16.61,32.82 16.61,32.97 15.66,33.92 14.46,33.92 14.21,33.67 11.86,33.67 11.66,33.87 9.16,33.87 8.81,34.22 v8.47,34.22
  Bottom 0.305: 8.46,34.52 7.76,34.52 6.86,35.42 5.71,35.42 3.95,37.18 3.95,38.69 3.3,39.34 3.3,39.78 3.07,40.01 3.07,48.31 3.53,48.77 R15.1 | 8.46,34.52 9.36,33.62 9.61,33.62 R16.1 | RF1.12 16.76,32.77 v17.56,31.97 | v8.47,34.22 8.45,34.51 8.46,34.52
N$9
  Bottom 0.406: ANT.TP 12.81,23.27 14.21,24.67 15.16,24.67 RF1.8
N$10
  Top 1.016: IC4.2 52.27,16.78 52.76,17.27 54.76,19.27 54.78,19.27 D1.C
  Top 1.422: 54.78,19.27 57.76,19.27 59.76,17.27 59.76,13.27 59.76,13.83 L1.1
N$12
  Bottom 0.406: IC2.6 26.95,48.1 | 26.95,48.1 26.02,48.1 D2.2 | L2.1 27.31,47.74 26.95,48.1
N$13
  Bottom 0.406: IC2.7 25.72,50.61 25.7,50.61 25.7,49.69 24.86,48.85 24.48,48.85 24.14,48.51 24.14,47.99 D2.1 23.64,48.45 L3.1
N$15
  Bottom 0.305: R11.2 34.07,30.58 34.07,31.52 32.82,32.77 RF1.3
N$29
  Bottom 0.305: IC1.29 32.65,66.22 33.6,66.22 34.2,66.82 34.2,67.36 35.31,68.47 35.31,68.87 C11.2
PB  (via drill 0.6)
  Top 0.305: 28.05,78.77 v26.9,78.77 28.05,78.77 | 28.05,78.77 29.76,78.77 v34.76,78.77 | v24.93,68.94 24.24,69.63 22.12,69.63 20.16,71.59 v20.16,72.91
  Bottom 0.305: IC1.35 30.05,61.26 30.05,64.54 25.65,68.94 v24.93,68.94 | v34.76,78.77 45.26,78.77 48.58,82.09 T1.2 | v26.9,78.77 26.9,77.32 26.45,76.87 26.03,76.87 25.67,76.51 23.68,74.52 22.57,74.52 22.36,74.52 20.75,72.91 v20.16,72.91
PG  (via drill 0.6)
  Top 0.305: v24.22,67.46 24.22,67.81 23.87,68.16 23.87,68.37 23.31,68.93 20.7,68.93 20.61,69.02 19.98,69.65 19.95,69.68 19.71,69.92 19.71,70.87 18.95,71.63 18.95,73.06 19.86,73.97 20.61,73.97 21.26,74.62 21.55,74.62 22.17,75.24 22.81,75.24 24.63,77.06 24.63,78.66 24.63,78.97 25.42,79.76 25.42,79.77 v36.26,79.77
  Bottom 0.305: IC1.36 29.25,61.26 29.25,63.84 25.63,67.46 v24.22,67.46 | T1.4 46.04,81.05 45.26,80.27 44.76,79.77 v36.26,79.77
PR  (via drill 0.6)
  Top 0.305: v33.86,45.5 v33.86,42.01 | v32.09,59.53 32.3,59.53 34.21,57.62 37.49,57.62 v37.52,57.65
  Bottom 0.305: IC1.37 28.42,60.18 28.76,59.84 31.3,59.84 31.61,59.53 v32.09,59.53 | T2.2 37.44,21.69 36.74,22.39 36.74,26.83 37.07,27.16 37.07,31.35 35.56,32.86 35.56,37.91 33.86,39.61 v33.86,42.01 | v33.86,45.5 33.86,47.94 34.33,48.41 34.33,52.35 34.89,52.91 34.89,53.5 35.71,54.32 35.71,55.07 37.41,56.77 37.41,57.54 v37.52,57.65
R
  Bottom 0.406: -R.TP 40.25,34.76 40.26,34.77
  Bottom 1.016: R7.2 40.26,24.98 40.26,33.76 | 40.26,33.76 40.26,34.77 | R.TP 41.81,33.76 40.26,33.76
RF12R  (via drill 0.6)
  Top 0.305: v9.62,34.82 11.66,34.82 12.06,34.42 13.71,34.42 13.91,34.62 16.36,34.62 v17.83,33.15
  Bottom 0.305: IC1.43 23.63,60.15 23.44,59.96 22.1,59.96 22.09,59.95 19.35,59.95 18.54,59.14 16.96,59.14 16.71,59.39 14.14,59.39 11.18,56.43 9.6,56.43 7.81,54.64 7.81,50.72 6.66,49.57 6.66,47.47 5.96,46.77 4.71,46.77 4.31,46.37 4.31,40.52 4.51,40.32 4.51,40.12 5.26,39.37 5.26,37.92 6.26,36.92 8.91,36.92 9.62,36.21 v9.62,34.82 | R8.1 28.17,23.09 28.17,26.27 21.29,33.15 v17.83,33.15
RXD  (via drill 0.6)
  Top 0.305: v23.35,57.27 21.27,57.27 19.92,58.59 19.93,64.1 20.34,64.51 20.34,66.81 21.54,68.01 v22.86,68.01
  Bottom 0.305: IC1.9 21.05,69.42 22.94,69.42 23.11,69.59 | 23.11,69.59 23.63,70.11 23.92,70.4 23.92,71.36 23.63,71.65 IC1.13 | IC2.1 24.41,57.16 24.33,57.25 23.83,57.27 v23.35,57.27 | v22.86,68.01 23.11,68.26 23.11,69.59
SCK  (via drill 0.6)
  Top 0.305: ISP.3 9.08,61.62 8.03,60.57 5.67,60.57 3.98,58.88 v3.98,56.76
  Bottom 0.305: IC1.3 21,64.61 18.11,64.61 15.95,62.4 15.94,62.41 9.65,62.41 ISP.3 | v3.98,56.76 4.27,56.47 R13.2
SS  (via drill 0.6)
  Top 0.305: v17.82,35.21 17.78,35.25 13.44,35.25 13.3,35.11 12.4,35.11 11.71,35.8 8.92,35.8 8.6,35.48 v8.24,35.48 8.2,35.52 5.01,35.52 4.31,34.82 v4.31,34.37
  Bottom 0.305: IC1.44 19.73,61.24 18.32,59.83 17.43,59.83 17.15,60.11 17.14,60.1 13.86,60.1 10.94,57.18 9.28,57.18 7.14,55.04 7.14,51.01 6.01,49.88 6.01,47.76 5.71,47.46 4.45,47.46 3.7,46.71 3.7,40.22 3.91,40.01 3.91,39.77 4.6,39.08 4.6,37.57 5.94,36.23 7.94,36.23 8.24,35.93 v8.24,35.48 | RF1.14 15.84,36.19 16.83,36.19 v17.81,35.21 v17.82,35.21 | R10.2 5.41,33.27 v4.31,34.37
TXD  (via drill 0.6)
  Top 0.305: v18.76,70.27 18.76,69.12 18.76,67.14 19.5,66.4 19.5,65.02 19.17,64.69 19.17,58.27 19.76,57.68 20.8,56.64 22.52,56.64 23,56.16 v23,55.15
  Bottom 0.305: IC2.4 28.23,54.99 28.23,54.05 28,53.82 23.55,53.82 23,54.37 23,55.47 v23,55.15 | v18.76,70.27 18.79,70.24 IC1.10
VBUS  (via drill 0.6)  (7 unrouted)
  Top 0.305: v19.34,38.42 19.31,38.39 19.31,26.22
  Top 0.406: 54.76,15.27 54.14,15.27 IC4.1
  Top 1.422: 13.14,26.27 11.04,26.27 JP1.2
  Top 1.676: v56.26,15.27 54.76,15.27 | C9.+ 29.02,10.08 v28.26,10.08 27.94,10.08 | 19.26,26.27 19.31,26.22 | 19.85,25.68 v19.87,25.68
  Top 2.54: 13.14,26.27 19.26,26.27 | 19.31,26.22 19.85,25.68 | 20.06,25.52 20.81,25.52 | 28.31,10.67 28.31,11.42
  Bottom 0.305: v19.34,38.42 19.34,40.63 19.67,40.96 23.65,40.96 24.04,41.35 28.26,41.35 32.89,45.92 32.98,46.01 32.98,48.33 33.48,48.83 33.48,52.64 34.16,53.32 34.16,53.87 34.96,54.67 34.96,55.42 36.51,56.97 36.51,59.49 R2.2
  Bottom 1.422: 78.62,43.44 XOUT.1 78.68,43.42 79.81,43.42 | 78.62,37.08 78.61,37.07 | XOUT.5 78.76,48.42 79.91,48.42 | XOUT.3 78.75,46.12 79.81,46.12
  Bottom 1.676: 28.44,10.08 v28.26,10.08 28.76,10.08 | v19.87,25.68 20.06,25.49
  Bottom 2.54: 78.61,37.07 78.61,25.43 77.61,24.43 73.9,24.43 71.99,22.52 71.99,15.38 65.31,8.7 61.52,8.7 56.26,13.96 v56.26,15.27 44.26,15.27 43.26,14.27 43.26,5.27 41.76,3.77 38.46,3.77 37.56,4.67 35.11,4.67 33.56,6.22 32.11,6.22 29.01,9.32 29.01,9.83 28.76,10.08 | 20.06,25.49 22.75,25.49 25.93,22.31 25.93,17.63 28.26,15.3 v28.26,10.08 | 78.62,37.08 77.86,37.84 77.86,40.57 79.81,42.52 79.81,43.42 79.81,46.12 79.81,48.32 79.91,48.42 81.51,50.02 81.51,52.01 80.64,52.87 80.66,52.77 80.31,53.12 80.26,53.12 79.33,53.9 78.39,54.84 DC.P$4
  other vias: 20.41,24.67 20.86,26.22 55.11,15.27 27.61,11.47 28.76,11.47
VBUSOUT
  Bottom 1.27: XIN.1 16.88,52.14 arc-90 16.81,52.22 16.61,52.22 arc90 15.86,51.47 | XIN.3 15.94,49.6 arc90 15.86,49.52 | 16.95,46.98 15.9,46.98
  Bottom 1.422: XIN.5 16.95,46.98 | JP1.1 11.05,28.82 11.51,28.82 12.51,29.82 12.51,33.97 11.21,35.27 11.21,37.23 10.66,37.78 10.66,38.57
  Bottom 2.54: 15.86,51.47 15.86,49.52 15.86,47.02 15.9,46.98 14.44,45.47 10.82,45.47 arc90 7.33,42.13 7.33,41.9 arc90 10.66,38.57
VREG  (via drill 0.6)
  Top 0.61: v49.26,76.77 44.76,81.27 v44.76,83.77
  Top 1.27: C10.+ 84.76,30.34 84.76,28.27 84.26,27.77 v74.76,27.77
  Top 1.422: L1.2 69.49,16.18 v68.29,17.25
  Bottom 0.406: SJ1.1 35.93,82.32 37.19,82.32 37.54,82.67 IC3.8 37.55,84.82 39.29,84.82 39.87,84.24 C3.1 | R9.1 65.64,17.4 C6.2 65.74,19.59 68.3,19.59 | 52.88,27.51 53.26,27.51 53.26,32.26 53.26,32.71 +U.TP
  Bottom 0.61: 55.27,35 62.26,41.99 62.26,53.27 60.26,53.27 58.76,54.77 58.76,55.27 58.26,55.77 58.26,59.27 58.76,59.77 58.76,62.77 57.26,64.27 57.26,76.77 56.76,77.27 53.26,77.27 52.76,76.77 v49.26,76.77 | v44.76,83.77 44.29,84.24 C3.1
  Bottom 1.016: 5_V.TP 53.15,32.26 53.26,32.26
  Bottom 1.27: v74.76,27.77 71.76,27.77 69.76,25.77 68.3,24.31 68.3,19.59
  Bottom 1.422: 55.27,35 55.27,34.49 52.88,32.1 52.88,27.51 54.85,25.54 59.99,25.54 63.22,28.77 66.26,28.77 69.26,25.77 69.76,25.77 | v68.29,17.25 68.3,19.59
XTAL1
  Bottom 0.305: IC1.7 17.08,67.83 15.32,66.07 15.32,64.93 | 15.32,64.93 Q1.2 | C5.2 13.84,66.41 15.32,64.93
XTAL2
  Bottom 0.305: IC1.8 17.01,68.64 16.41,69.23 Q1.1 14.22,70.25 14.22,70.61 12.91,71.93 11.5,71.93 C4.2

### Text on the board
tPlace: GND | 24 V | 1
tNames: ML-BUS | S+RFguy 2014